# EAGLE board openbook (EAGLE 9.7.0)
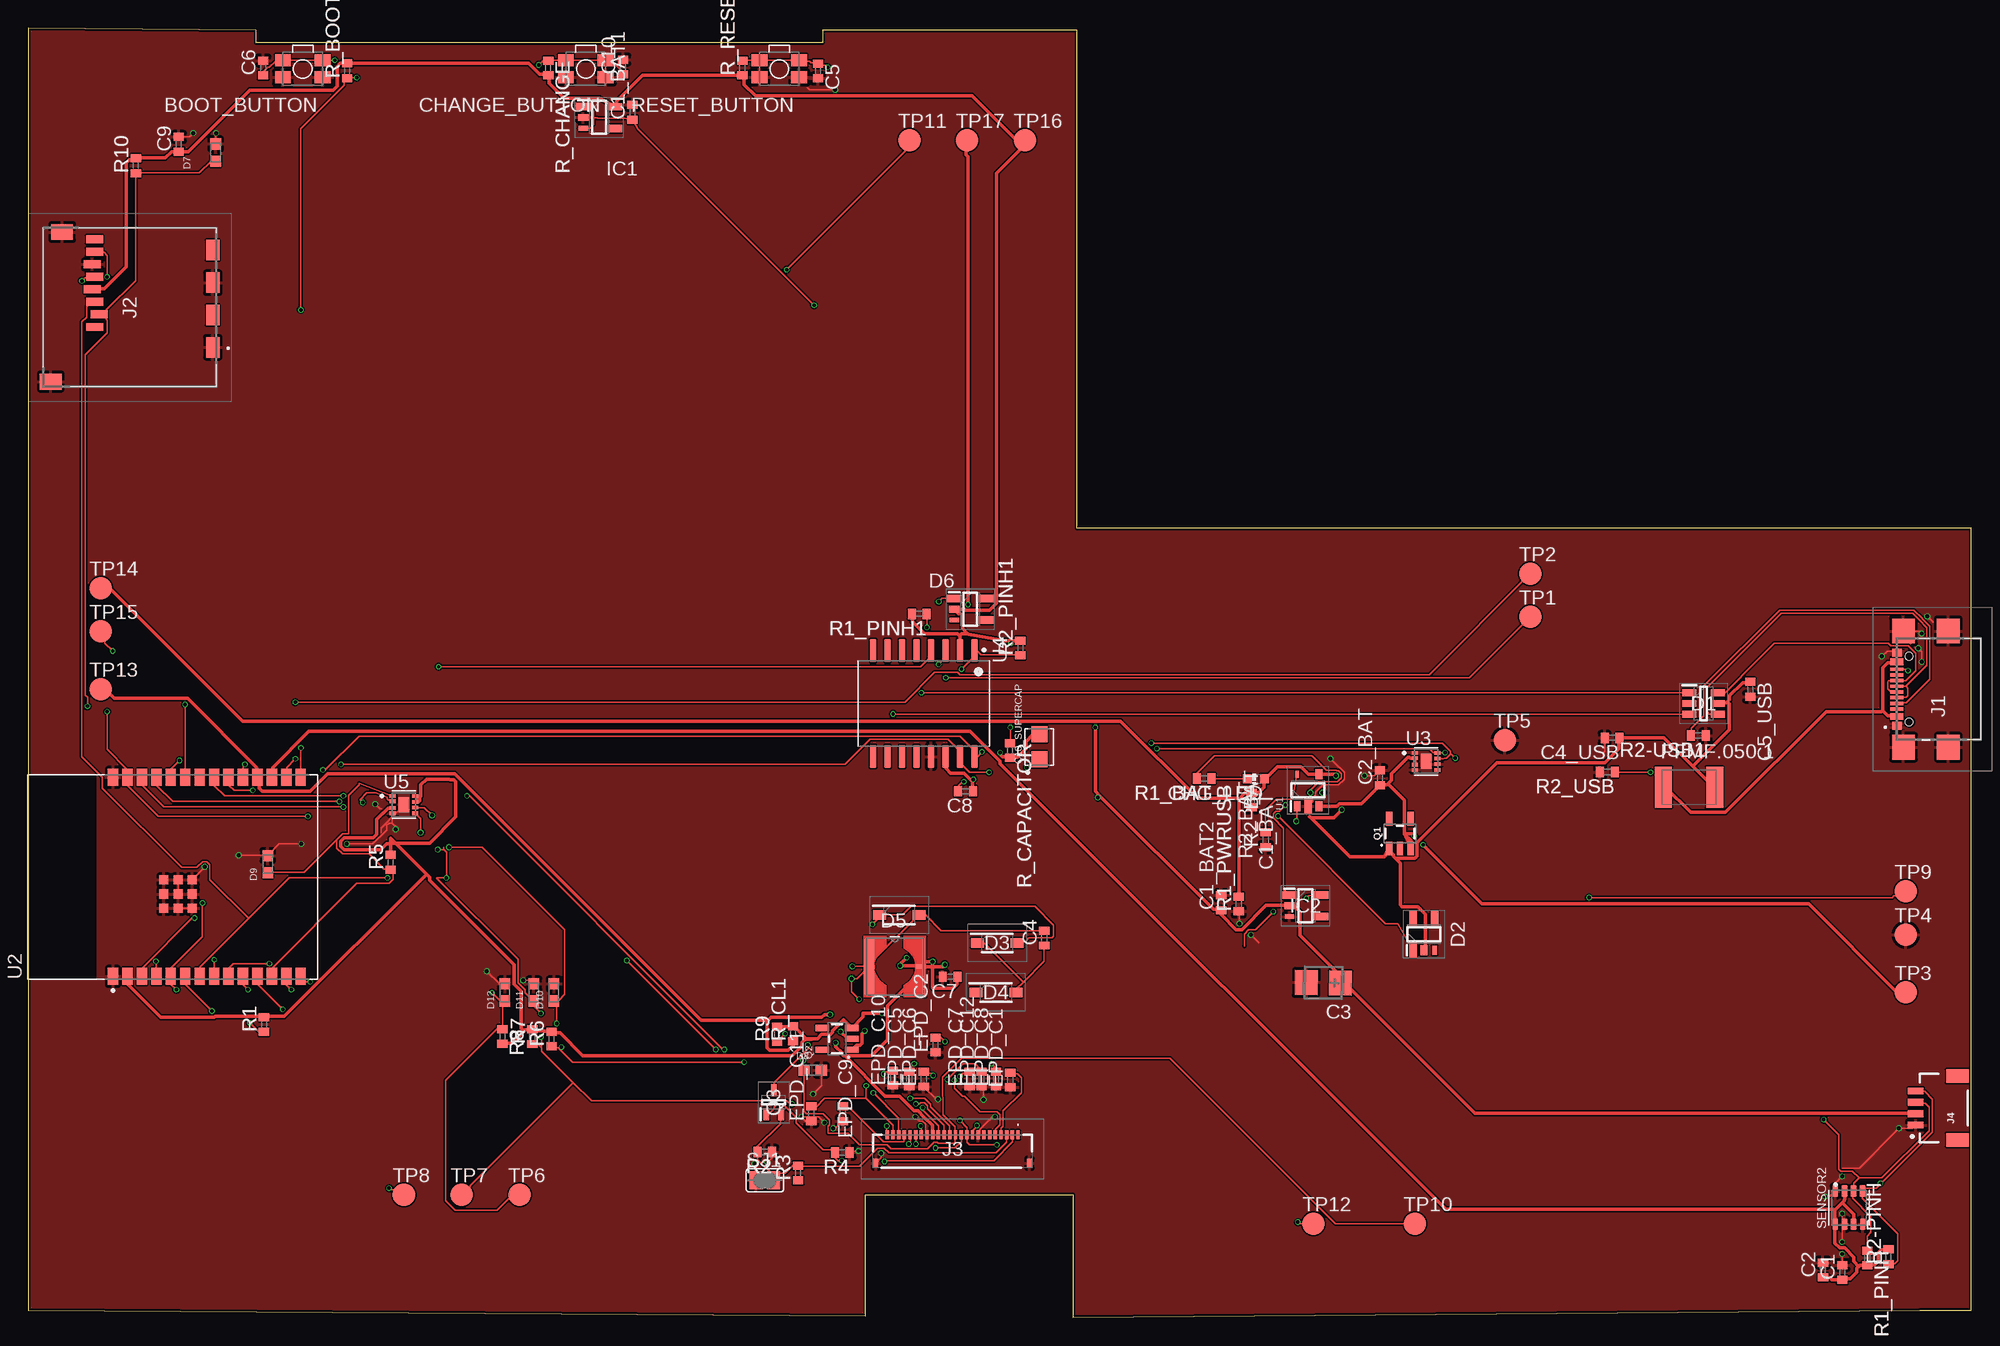
[diagram p1: board, top side]
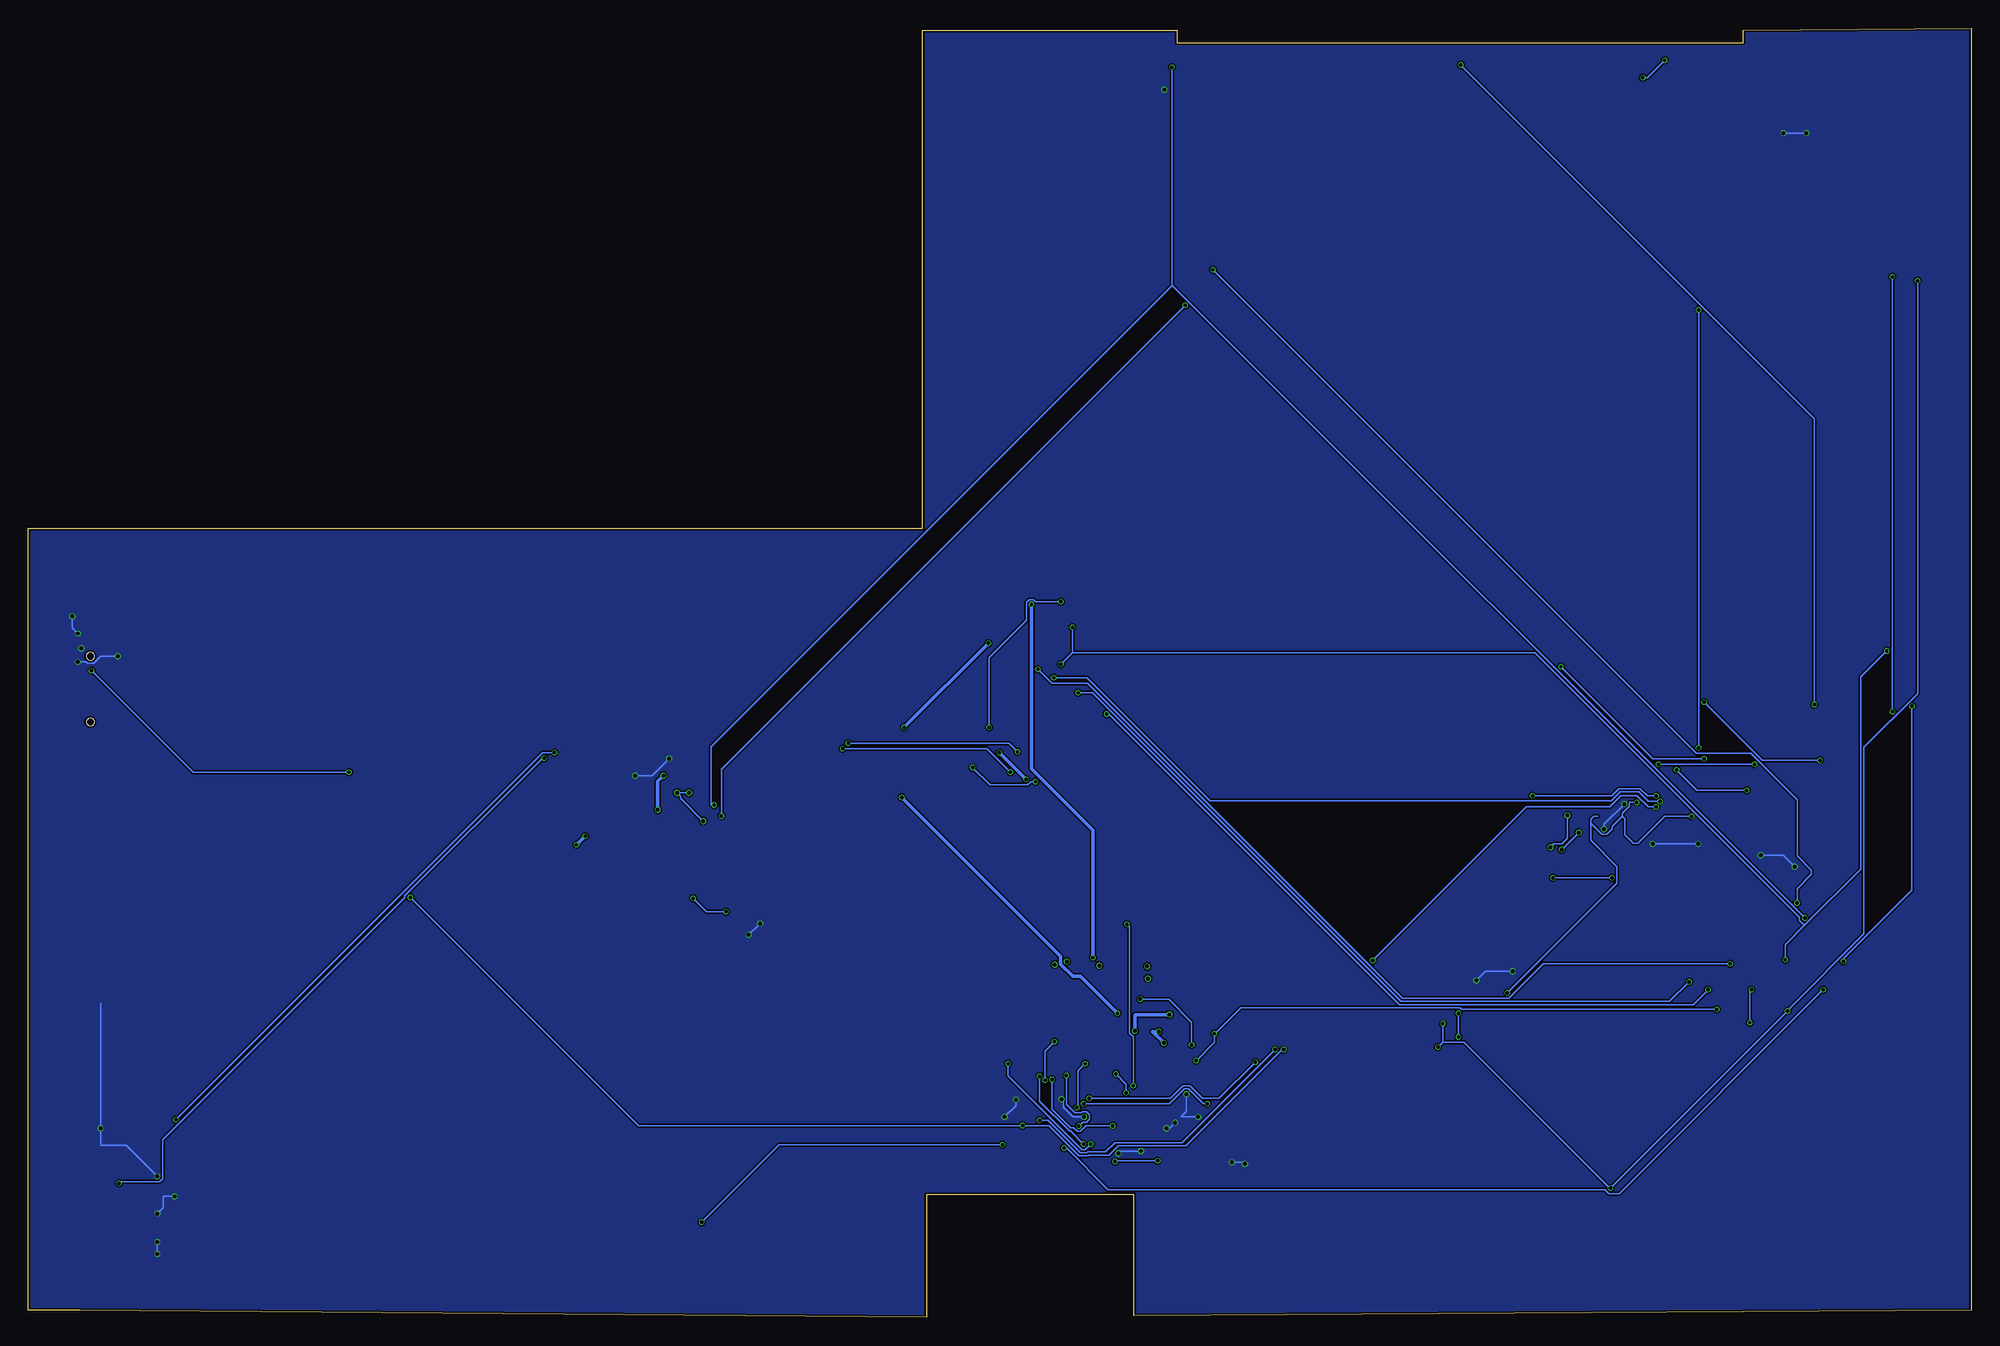
[diagram p2: board, bottom side, seen from below]

Size 170.85 x 113.33 mm. Coordinates in mm from the lower left corner, seen from the top.
Outline: 0,113.33 0,0.63 73.62,0.13 73.62,10.79 73.64,10.77 91.86,10.77 91.86,0 166.35,0.63 170.85,0.63 170.85,69.39 92.22,69.39 92.22,113.19 69.85,113.19 69.85,112.06 20.04,112.06 20.04,113.19 0,113.33
Copper layers (1*16): Top 0.035mm / dielectric 1.6mm / Bottom 0.035mm
Design rules "jlcpcb-2layers.dru": minimum track width 0.15mm, minimum drill 0.3mm, track to track 5mil, track to pad 5mil, pad to pad 5mil, via to via 5mil, smd to smd 5mil, copper to edge 0.2mm, drill to drill 6mil, minimum pad ring 10mil, minimum via ring 3mil, stop-mask expansion 4mil, vias tented up to drill 0mil, thermal gap 10mil
Net classes: 1 POWER: width 0.3 mm

## Footprints (pad centres in the part's own frame; a part is rotated, then mirrored left to right if it is on the bottom)
MYBUTTON = smd 1.4 x 1.05: 1 1.75,0.75; 2 -1.75,0.75; 3 -1.75,-0.75; 4 1.75,-0.75
ESP32_WROVER_EAGLE-LTSPICE_C0402 = smd 0.7 x 0.9: 1 -0.65,0; 2 0.65,0
RCL_CT3528 = smd 2 x 2.2: + -1.5,0; - 1.5,0
CAPCP3225X100N = smd 1.4 x 1.4: 1 -1.1,0; 2 1.1,0
ADAFRUIT_CHIP-LED0603 = smd 0.8 x 0.8: A 0,-0.75; C 0,0.75
SOT95P280X145-6N = smd 1.2 x 0.6: 1 -1.25,0.95; 2 -1.25,0; 3 -1.25,-0.95; 4 1.25,-0.95; 5 1.25,0; 6 1.25,0.95
SOT95P280X120-5N = smd 1.27 x 0.66: 1 -1.4,0.95; 4 1.4,-0.95 | smd 0.9 x 0.6: 2 -1.4,0 | smd 0.813 x 0.406: 3 -1.4,-0.95 | smd 1.27 x 0.635: 5 1.4,0.95
SOD3716X135N = smd 1.15 x 0.8: 1 -1.75,0; 2 1.75,0
DIOC1608X36N = smd 0.97 x 0.94: 1 -0.75,0; 2 0.75,0
SAMACSYS_PARTS_USB4110GFA = smd 0.406 x 0.813: A1 -3.35,3.678; A12 3.35,3.678; B1 3.05,3.678; B12 -3.05,3.678 | smd 0.3 x 1.15: A4 -2.55,3.678; A5 -1.25,3.678; A6 -0.25,3.678; A7 0.25,3.678; A8 1.25,3.678; A9 2.55,3.678; B4 2.25,3.678; B5 1.75,3.678; B6 0.75,3.678; B7 -0.75,3.678; B8 -1.75,3.678; B9 -2.25,3.678 | smd 2.18 x 2: MP1 -5.11,-0.827; MP2 5.11,-0.827; MP3 -5.11,3.103; MP4 5.11,3.103 | hole 0.65: -2.89,2.603; 2.89,2.603
112ATAARR03ATTEND = smd 1.8 x 1.2: G1 10.6,10.4; G2 4.9,10.4; S1 7.75,10.4; S2 2.05,10.4 | smd 1.4 x 1.9: G3 13.6,-3.85; G4 0.45,-2.85 | smd 0.7 x 1.5: P1 8.8,0; P2 7.7,0.4; P3 6.6,0; P4 5.5,-0.2; P5 4.4,0; P6 3.3,-0.2; P7 2.2,0; P8 1.1,0
FH34SRJ24S05SH99 = smd 0.3 x 0.8: 1 5.75,1.45; 2 5.25,1.45; 3 4.75,1.45; 4 4.25,1.45; 5 3.75,1.45; 6 3.25,1.45; 7 2.75,1.45; 8 2.25,1.45; 9 1.75,1.45; 10 1.25,1.45; 11 0.75,1.45; 12 0.25,1.45; 13 -0.25,1.45; 14 -0.75,1.45; 15 -1.25,1.45; 16 -1.75,1.45; 17 -2.25,1.45; 18 -2.75,1.45; 19 -3.25,1.45; 20 -3.75,1.45; 21 -4.25,1.45; 22 -4.75,1.45; 23 -5.25,1.45; 24 -5.75,1.45 | smd 0.4 x 0.8: MP1 6.75,-1.05; MP2 -6.75,-1.05
JST04_1MM_RA = smd 0.6 x 1.35: 1 -1.5,0; 2 -0.5,0; 3 0.5,0; 4 1.5,0 | smd 1.2 x 2: NC1 2.8,-3.675; NC2 -2.8,-3.675
IND_4828-WE-TPC_WRE = smd 0.889 x 4.826: 1 -2.286,0 | smd 0.813 x 0.406: 2 2.286,0
ESP32C6_VARISTOR_CT/CN1812 = smd 1.5 x 3.6: 1 -2.25,0; 2 2.25,0
ESP32_WROVER_SPARKFUN-IC-POWER_SOT23-5 = smd 0.55 x 1.2: 1 -0.95,-1.3; 2 0,-1.3; 3 0.95,-1.3; 4 0.95,1.3; 5 -0.95,1.3
SOT65P210X110-3N = smd 1.05 x 0.5: 1 -1.05,0.65; 2 -1.05,-0.65; 3 1.05,0
ESP32_WROVER_EAGLE-LTSPICE_R0402 = smd 0.7 x 0.9: 1 -0.65,0; 2 0.65,0
ESP32_WROVER_BME680_PSON80P300X300X100-8N = smd 1.016 x 0.5: 1 1.458,1.2; 2 1.458,0.4; 3 1.458,-0.4; 4 1.458,-1.2; 5 -1.458,-1.22; 6 -1.458,-0.4; 7 -1.458,0.4; 8 -1.458,1.2
SJ = smd 1.168 x 1.6: 1 -0.762,0; 2 0.762,0
TP20R = smd 2 x 2: TP 0,0
SOT95P280X125-5N = smd 0.9 x 0.6: 1 -1.4,0.95; 3 -1.4,-0.95; 4 1.4,-0.95 | smd 1.27 x 0.66: 2 -1.4,0 | smd 0.61 x 0.305: 5 1.4,0.95
XCVR_ESP32-C6-WROOM-1-N8 = smd 1.5 x 0.9: 1 -8.75,5.26; 2 -8.75,3.99; 3 -8.75,2.72; 4 -8.75,1.45; 5 -8.75,0.18; 6 -8.75,-1.09; 7 -8.75,-2.36; 8 -8.75,-3.63; 9 -8.75,-4.9; 10 -8.75,-6.17; 11 -8.75,-7.44; 12 -8.75,-8.71; 13 -8.75,-9.98; 14 -8.75,-11.25; 15 8.75,-11.25; 16 8.75,-9.98; 17 8.75,-8.71; 18 8.75,-7.44; 19 8.75,-6.17; 20 8.75,-4.9; 21 8.75,-3.63; 22 8.75,-2.36; 23 8.75,-1.09; 24 8.75,0.18; 25 8.75,1.45; 26 8.75,2.72; 27 8.75,3.99; 28 8.75,5.26 | smd 0.8 x 0.8: 29_1 -2.755,0.79; 29_2 -1.505,0.79; 29_3 -0.255,0.79; 29_4 -2.755,-0.46; 29_5 -1.505,-0.46; 29_6 -0.255,-0.46; 29_7 -2.755,-1.71; 29_8 -1.505,-1.71; 29_9 -0.255,-1.71
SON50P200X200X80-9N = smd 0.61 x 0.305: 1 -0.985,0.75; 2 -0.985,0.3; 3 -0.985,-0.3; 4 -0.985,-0.75; 5 0.985,-0.75; 6 0.985,-0.25; 7 0.985,0.25; 8 0.985,0.75 | smd 0.9 x 1.3: 9 0,0
SOIC127P1032X265-16N = smd 2.05 x 0.59: 1 -4.655,4.445; 2 -4.655,3.175; 3 -4.655,1.905; 4 -4.655,0.635; 5 -4.655,-0.635; 6 -4.655,-1.905; 7 -4.655,-3.175; 8 -4.655,-4.445; 9 4.655,-4.445; 10 4.655,-3.175; 11 4.655,-1.905; 12 4.655,-0.635; 13 4.655,0.635; 14 4.655,1.905; 15 4.655,3.175; 16 4.655,4.445

## Placement (x,y rotation side)
BOOT_BUTTON  BUTTON_CUSYOMV1  [MYBUTTON]  24.13,109.77 180 top
C1  100nF  [ESP32_WROVER_EAGLE-LTSPICE_C0402]  159.52,3.94 90 top
C1_BAT  4.7uF  [ESP32_WROVER_EAGLE-LTSPICE_C0402]  107.58,45.49 270 top
C1_BAT1  4.7uF  [ESP32_WROVER_EAGLE-LTSPICE_C0402]  53.12,105.96 90 top
C1_BAT2  4,7uF  [ESP32_WROVER_EAGLE-LTSPICE_C0402]  104.89,36.46 90 top
C2  100nF  [ESP32_WROVER_EAGLE-LTSPICE_C0402]  157.82,4.16 90 top
C2_BAT  4.7uF  [ESP32_WROVER_EAGLE-LTSPICE_C0402]  118.85,47.45 90 top
C3  100uF TANT  [RCL_CT3528]  113.88,29.42 179 top
C4  4.7uF/25V  [ESP32_WROVER_EAGLE-LTSPICE_C0402]  89.34,33.35 90 top
C4_USB  100nF  [ESP32_WROVER_EAGLE-LTSPICE_C0402]  139.28,50.95 180 top
C5  1uF  [ESP32_WROVER_EAGLE-LTSPICE_C0402]  69.45,109.58 270 top
C5_USB  4.7uF  [ESP32_WROVER_EAGLE-LTSPICE_C0402]  151.43,55.22 270 top
C6  100nF  [ESP32_WROVER_EAGLE-LTSPICE_C0402]  20.64,109.85 90 top
C7  10uF  [ESP32_WROVER_EAGLE-LTSPICE_C0402]  81.06,29.94 180 top
C8  100nF  [ESP32_WROVER_EAGLE-LTSPICE_C0402]  82.41,46.26 180 top
C9  100nF  [ESP32_WROVER_EAGLE-LTSPICE_C0402]  13.22,103.15 90 top
C10  100nF  [ESP32_WROVER_EAGLE-LTSPICE_C0402]  52.29,109.94 90 top
C10_SUPERCAP  CPH3225A  [CAPCP3225X100N]  88.9,50.16 90 top
CHANGE_BUTTON  BUTTON_CUSYOMV1  [MYBUTTON]  49.02,109.77 180 top
CHG_LED  [ADAFRUIT_CHIP-LED0603]  107.95,47.35 90 top
D1  USBLC6-2SC6Y  [SOT95P280X145-6N]  147.32,53.97 0 top
D2  ESP32_WROVER_AVX---SD0805S020S1R0_AVX_SD0805S020S1R0_0_0AVX_SD0805S020S1R0_0_0  [SOT95P280X120-5N]  122.72,33.69 90 top
D3  MBR0530  [SOD3716X135N]  85.2,32.92 0 top
D4  MBR0530  [SOD3716X135N]  85.09,28.57 0 top
D5  MBR0530  [SOD3716X135N]  76.59,35.38 0 top
D6  ESP32_WROVER_AVX---SD0805S020S1R0_AVX_SD0805S020S1R0_0_0AVX_SD0805S020S1R0_0_0  [SOT95P280X120-5N]  82.82,62.26 0 top
D7  PGB1010603MR  [DIOC1608X36N]  16.47,102.42 90 top
D8  PGB1010603MR  [DIOC1608X36N]  68.98,21.73 0 top
D9  PGB1010603MR  [DIOC1608X36N]  21.05,39.86 90 top
D10  PGB1010603MR  [DIOC1608X36N]  46.22,28.57 90 top
D11  PGB1010603MR  [DIOC1608X36N]  44.45,28.57 90 top
D12  PGB1010603MR  [DIOC1608X36N]  41.91,28.57 90 top
EPD_C1  1uF/50V  [ESP32_WROVER_EAGLE-LTSPICE_C0402]  86.35,20.87 90 top
EPD_C2  1uF/50V  [ESP32_WROVER_EAGLE-LTSPICE_C0402]  79.77,23.95 90 top
EPD_C5  1uF/50V  [ESP32_WROVER_EAGLE-LTSPICE_C0402]  77.47,20.95 90 top
EPD_C6  1uF/50V  [ESP32_WROVER_EAGLE-LTSPICE_C0402]  78.74,20.95 90 top
EPD_C7  1uF/50V  [ESP32_WROVER_EAGLE-LTSPICE_C0402]  82.79,20.95 90 top
EPD_C8  1uF/50V  [ESP32_WROVER_EAGLE-LTSPICE_C0402]  85.09,20.95 90 top
EPD_C9  1uF/50V  [ESP32_WROVER_EAGLE-LTSPICE_C0402]  71.62,17.91 90 top
EPD_C10  1uF/50V  [ESP32_WROVER_EAGLE-LTSPICE_C0402]  76.02,21.05 90 top
EPD_C11  1uF/50V  [ESP32_WROVER_EAGLE-LTSPICE_C0402]  68.85,17.91 90 top
EPD_C12  1uF/50V  [ESP32_WROVER_EAGLE-LTSPICE_C0402]  83.82,20.95 90 top
IC1  XC6220A331MR-G  [SOT95P280X120-5N]  50.19,105.5 0 top
IC2  BD5229G-TR  [SOT95P280X120-5N]  112.3,36.19 0 top
J1  SAMACSYS_PARTS_USB4110-GF-A  [SAMACSYS_PARTS_USB4110GFA]  168,55.24 90 top
J2  112A-TAAR-R03_ATTEND  [112ATAARR03ATTEND]  5.82,95.88 270 top
J3  FH34SRJ-24S-0.5SH_99_  [FH34SRJ24S05SH99]  81.28,14.6 0 top
J4  QWIIC_RIGHT_ANGLE  [JST04_1MM_RA]  165.97,18.41 90 top
L1  68uH  [IND_4828-WE-TPC_WRE]  76.2,30.84 0 top
PFMF.050.1  ESP32C6_VARISTORCN1812  [ESP32C6_VARISTOR_CT/CN1812]  146.05,46.62 0 top
Q1  20V/4.2A/52mΩ/1.4W  [ESP32_WROVER_SPARKFUN-IC-POWER_SOT23-5]  120.61,42.54 0 top
Q2  20V/4.2A/52mΩ/1.4W  [ESP32_WROVER_SPARKFUN-IC-POWER_SOT23-5]  71.12,24.49 90 top
Q3  SI1308EDL-T1-GE3  [SOT65P210X110-3N]  65.54,18.91 90 top
R1  10K  [ESP32_WROVER_EAGLE-LTSPICE_R0402]  20.72,25.76 90 top
R1_BAT  200  [ESP32_WROVER_EAGLE-LTSPICE_R0402]  103.4,47.38 180 top
R1_PINH  10K  [ESP32_WROVER_EAGLE-LTSPICE_R0402]  161.71,5.23 270 top
R1_PINH1  10K  [ESP32_WROVER_EAGLE-LTSPICE_R0402]  78.35,61.85 180 top
R1_PWRUSB  100K  [ESP32_WROVER_EAGLE-LTSPICE_R0402]  106.44,36.35 90 top
R2  2.2  [ESP32_WROVER_EAGLE-LTSPICE_R0402]  64.76,14.54 180 top
R2-PINH  10K  [ESP32_WROVER_EAGLE-LTSPICE_R0402]  163.58,5.33 90 top
R2-USB1  5k1  [ESP32_WROVER_EAGLE-LTSPICE_R0402]  146.86,51.16 180 top
R2_BAT  2K  [ESP32_WROVER_EAGLE-LTSPICE_R0402]  108.81,41.99 90 top
R2_PINH1  10K  [ESP32_WROVER_EAGLE-LTSPICE_R0402]  87.23,58.85 90 top
R2_USB  5K1  [ESP32_WROVER_EAGLE-LTSPICE_R0402]  138.86,47.95 180 top
R3  0.47  [ESP32_WROVER_EAGLE-LTSPICE_R0402]  67.68,12.69 90 top
R4  10K  [ESP32_WROVER_EAGLE-LTSPICE_R0402]  71.57,14.5 180 top
R5  10K  [ESP32_WROVER_EAGLE-LTSPICE_R0402]  31.86,40.01 90 top
R6  10K  [ESP32_WROVER_EAGLE-LTSPICE_R0402]  46.01,24.47 90 top
R7  10K  [ESP32_WROVER_EAGLE-LTSPICE_R0402]  44.32,24.69 90 top
R8  10K  [ESP32_WROVER_EAGLE-LTSPICE_R0402]  41.69,24.69 270 top
R9  10K  [ESP32_WROVER_EAGLE-LTSPICE_R0402]  65.84,24.89 90 top
R10  10K  [ESP32_WROVER_EAGLE-LTSPICE_R0402]  9.45,101.26 90 top
R_BOOT  10k  [ESP32_WROVER_EAGLE-LTSPICE_R0402]  28.04,109.6 90 top
R_CAPACITOR  15  [ESP32_WROVER_EAGLE-LTSPICE_R0402]  86.32,49.85 270 top
R_CHANGE  10k  [ESP32_WROVER_EAGLE-LTSPICE_R0402]  45.72,109.85 270 top
R_CL1  10K  [ESP32_WROVER_EAGLE-LTSPICE_R0402]  67.25,24.94 90 top
R_RESET  10k  [ESP32_WROVER_EAGLE-LTSPICE_R0402]  62.78,109.85 90 top
RESET_BUTTON  BUTTON_CUSYOMV1  [MYBUTTON]  66.04,109.77 180 top
SENSOR2  ESP32_WROVER_BME680_BME680  [ESP32_WROVER_BME680_PSON80P300X300X100-8N]  160.11,9.65 90 top
SJ1  [SJ]  64.77,12.06 0 top
TP1  TPTP20R  [TP20R]  132.08,61.59 0 top
TP2  TPTP20R  [TP20R]  132.08,65.4 0 top
TP3  TPTP20R  [TP20R]  165.1,28.57 0 top
TP4  TPTP20R  [TP20R]  165.1,33.65 0 top
TP5  TPTP20R  [TP20R]  129.84,50.75 0 top
TP6  TPTP20R  [TP20R]  43.18,10.79 0 top
TP7  TPTP20R  [TP20R]  38.1,10.79 0 top
TP8  TPTP20R  [TP20R]  33.02,10.79 0 top
TP9  TPTP20R  [TP20R]  165.1,37.46 0 top
TP10  TPTP20R  [TP20R]  121.92,8.25 0 top
TP11  TPTP20R  [TP20R]  77.47,103.5 0 top
TP12  TPTP20R  [TP20R]  113.03,8.25 0 top
TP13  TPTP20R  [TP20R]  6.35,55.24 0 top
TP14  TPTP20R  [TP20R]  6.35,64.13 0 top
TP15  TPTP20R  [TP20R]  6.35,60.32 0 top
TP16  TPTP20R  [TP20R]  87.63,103.5 0 top
TP17  TPTP20R  [TP20R]  82.55,103.5 0 top
U1  ESP32_WROVER_SPARKFUN-IC-POWER_MCP73831  [SOT95P280X125-5N]  112.53,46.35 90 top
U2  ESP32-C6-WROOM-1-N8  [XCVR_ESP32-C6-WROOM-1-N8]  12.7,38.73 90 top
U3  MAX17048G+T10  [SON50P200X200X80-9N]  122.92,48.89 0 top
U4  DS3231SN#  [SOIC127P1032X265-16N]  78.74,53.97 270 top
U5  W25Q512JVEIQ  [SON50P200X200X80-9N]  33.02,45.08 0 top

## Tracks (layer width: path | path; a pad name or v marks a point on that pad's centre or on a via)
3V3  (via drill 0.3)
  Top 0.3: U2.2 8.66,29.92 8.66,29.37 11.63,26.39 16.34,26.39 16.41,26.46 20.71,26.46 R1.2 20.84,26.46 22.51,26.46 35.01,38.96 | R9.2 65.86,25.56 67.24,25.56 R_CL1.2 67.36,25.56 68.4,24.52 68.9,24.52 | 43.59,25.18 43.7,25.28 44.32,25.28 R7.2 44.46,25.21 45.29,25.21 45.36,25.14 45.98,25.14 R6.2 46.05,25.01 46.74,25.01 48.75,23 67.15,23 68.04,23.89 68.04,24.18 68.33,24.47 68.85,24.47 68.9,24.52 | 43.59,25.18 42.52,24.11 41.76,24.11 R8.2 | U5.8 34.32,45.83 34.41,45.73 34.41,45.42 34.32,45.33 U5.7 34.51,45.83 34.51,46.83 35.01,47.33 37.01,47.33 37.08,47.26 37.4,47.26 37.59,47.07 37.59,44 35.28,41.69 31.99,41.69 31.86,41.63 | 31.86,41.63 31.86,42.11 35.01,38.96 | 31.86,41.63 31.86,40.73 R5.2 | J4.2 165.92,17.94 127.21,17.94 115.79,29.37 115.44,29.37 C3.+ 115.3,29.51 115.3,30.13 111.81,33.62 111.81,35.68 111.34,36.15 111.02,36.15 IC2.2 110.89,36.22 108.84,36.22 106.72,34.1 106.2,34.1 104.91,35.39 104.91,35.81 C1_BAT2.1 104.78,35.88 104.22,35.88 94.22,45.88 | J2.P4 5.68,90.45 6.65,90.45 8.59,92.39 8.59,101.53 8.86,101.8 9.35,101.8 R10.2 9.49,101.94 12.05,101.94 12.6,102.5 13.16,102.5 C9.1 13.37,102.5 14.06,102.5 19.46,107.9 26.8,107.9 27.15,108.24 27.15,109.98 27.42,110.25 27.91,110.25 R_BOOT.2 43.97,110.25 44.94,109.28 45.64,109.28 R_CHANGE.2 45.77,109.14 45.77,108.52 47.09,107.21 50.21,107.21 50.23,107.18 IC1.5 51.73,106.48 51.73,106.93 54.02,109.21 62.74,109.21 R_RESET.1 62.81,109.07 62.95,108.94 62.95,108.38 63.93,107.4 82.97,107.4 86.84,103.54 87.6,103.54 TP16.TP 87.25,103.4 87.25,102.7 85.13,100.58 85.13,62.78 84.53,62.18 82.42,62.18 82.34,62.26 D6.2 81.79,61.89 81.98,61.89 82.15,61.72 82.15,60.58 82.51,60.22 82.41,60.12
  Top 0.3: 81.89,59.94 81.92,59.91 81.92,58.66 U4.2 | 81.89,59.94 81.72,60.12 78.81,60.12 77.77,61.15 77.77,61.85 R1_PINH1.2 | 82.41,60.12 82.06,60.12 81.89,59.94 | 86.42,59.49 85.87,59.49 82.41,60.12 | 86.42,59.49 87.19,59.49 R2_PINH1.2 | 94.22,45.88 93.83,46.27 v93.83,51.87 | v86.42,59.28 86.42,59.49 | v75.07,26.74 73.42,26.74 73.42,26.44 Q2.3 71.67,26.19 70.7,25.22 70.7,25.05 70.53,24.89 69.76,24.89 69.4,24.52 68.9,24.52 | v94.04,45.71 94.22,45.88 | 43.59,25.18 43.34,25.44 43.34,28.66 42.7,29.3 42.7,31.01 35.27,38.44 35.27,38.7 35.01,38.96 | 31.86,41.63 31.5,41.63 30.97,41.1 27.78,41.1 27.47,41.41 27.47,41.85 27.78,42.16 30.32,42.16 30.65,42.48 30.65,43.82 31.15,44.33 31.2,44.33 31.64,44.76 32.01,44.76 U5.3
  Bottom 0.3: v86.42,59.28 v93.83,51.87 | v75.07,26.74 78.32,29.99 78.98,29.99 80.06,31.07 80.06,31.73 v94.04,45.71
32KHZ  (via drill 0.3)
  Top 0.15: R2_PINH1.1 87.19,58.25 83.79,58.25 83.38,58.66 83.24,58.66 U4.1 83.17,58.59 83.17,58.11 v82.06,57 | v21.19,31.1 18,31.1 17.66,30.75 17.66,29.99 U2.9
  Bottom 0.15: v21.19,31.1 37.6,31.1 40.65,28.05 50,28.05 77.7,55.75 80.81,55.75 v82.06,57
DN
  Top 0.15: 165.16,55.48 165.3,55.34 165.3,54.64 165.16,54.51 164.33,54.51 J1.B7 | 165.16,55.48 164.33,55.48 J1.A7 | D1.4 148.54,53.05 147.85,53.05 147.64,53.26 147.64,55.41 154.15,61.92 165.71,61.92 166.27,61.36 166.27,61.33 166.95,60.64 166.95,57.34 165.16,55.54 165.16,55.48
DP
  Top 0.15: J1.A6 164.26,54.99 163.78,54.99 163.5,55.27 163.5,55.89 163.57,55.96 164.26,55.96 J1.B6 164.33,55.96 165.09,55.96 166,56.87 166,58.38 165.32,59.06 164.68,59.06 164.5,59.06 163.79,59.06 163.57,59.28 153.53,59.28 150.62,56.38 150.62,56.31 149.23,54.92 148.61,54.92 D1.6
EPD_3V3  (via drill 0.3, 0.35)
  Top 0.3: C7.1 81.65,29.92 81.65,29.3 81.3,28.95 79.57,28.95 79.53,28.99 v79.53,31.28 78.93,31.28 L1.2 | J3.16 79.5,16.07 79.5,16.9 78.78,17.62 78.76,17.62 78.22,18.16 77.9,18.16 76.59,19.47 75.34,19.47 71.82,22.99 | L1.2 78.46,30.65 78.46,30.3 75.57,27.41 75.57,24.42 74.14,22.99 71.82,22.99 | v77.24,31.62 76.67,31.05 v76.67,30.92 78.4,30.92 L1.2 | TP17.TP 82.55,103.47 82.55,102.57 82.48,102.5 82.48,102.22 82.63,102.06 v82.63,62.68 | v80.59,31.01 80.42,30.84 L1.2 | 71.82,22.99 71.7,22.99 71.54,23.15 71.54,23.27 71,23.81 v71,24.13 | v71.44,25.13 72.08,24.49 Q2.2
  Bottom 0.3: v77.24,31.62 77.24,42.83 82.63,48.22 v82.63,62.68 | v71,24.13 72,25.13 v71.44,25.13
EPD_3V3_C  (via drill 0.35)
  Top 0.3: 64.96,26.04 64.96,23.69 65.16,23.48 66.83,23.48 67.24,23.9 67.24,24.24 R_CL1.1 | 64.96,26.04 65.3,26.39 69.74,26.39 69.75,26.38 70,26.63 v70.5,26.63 | TP13.TP 6.37,55.2 6.79,55.2 7.55,54.44 13.99,54.44 20.08,48.34 20.08,47.51 U2.18 20.29,47.44 20.29,46.54 20.57,46.27 24.79,46.27 26.32,47.79 37.48,47.79 59.15,26.11 64.82,26.11 64.96,26.04 | v73.55,25.19 73.3,24.94 73.3,24.1 73.14,23.94 72.82,23.94 Q2.1
  Bottom 0.3: v73.55,25.19 73.55,26.58 73.5,26.63 v70.5,26.63
EPD_BUSY  (via drill 0.3)
  Top 0.15: v137.25,36.92 163.91,36.92 164.05,37.05 164.19,37.05 164.54,37.4 165.09,37.4 TP9.TP | J3.9 83.03,16.07 83.03,16.42 83.41,16.8 v83.41,16.87 | v27.7,44.88 11.91,44.88 10.04,46.75 10.04,47.44 U2.26 | v60.45,23.55 v52.63,31.38
  Bottom 0.15: 83.45,16.83 117.17,16.83 v137.25,36.92 | v52.63,31.38 39.13,44.88 31.78,44.88 30.8,45.86 29.38,45.86 28.4,44.88 v27.7,44.88 | v60.45,23.55 60.59,23.55 69.06,15.08 75,15.08 75.81,14.27 77.56,14.27 77.63,14.2 78.46,14.2 81.09,16.83 83.45,16.83 | v83.41,16.87 83.45,16.83
EPD_CS  (via drill 0.3)
  Top 0.15: v66.55,24.94 65.86,24.24 R9.1 | v68.14,22.58 68.14,21.68 D8.1 68.21,21.68 68.2,21.67 68.2,18.13 68.42,17.91 69.86,17.91 70.45,17.32 70.45,16.94 70.31,16.8 70.31,16.18 72.09,16.18 73.1,15.17 75.49,15.17 75.85,14.81 79.07,14.81 79.64,15.38 79.92,15.38 79.98,15.31 81.44,15.31 81.51,15.38 81.51,16 J3.12 81.51,16.07 81.51,16.76 80.45,17.82 80.45,19.37 80.39,19.43 80.39,21.11 82.06,22.79 100.41,22.79 114.95,8.25 121.88,8.25 TP10.TP | v22.37,27.08 20.15,29.3 20.15,29.92 U2.11
  Bottom 0.15: v68.14,22.58 66.55,24.17 v66.55,24.94 66.48,24.94 64.19,27.22 44.94,27.22 44.8,27.08 v22.37,27.08
EPD_DC  (via drill 0.3)
  Top 0.15: v79.78,14.89 81.51,14.89 82.06,15.45 82.06,16 J3.11 | v13.02,28.81 12.53,29.3 12.53,29.92 U2.5 12.53,29.99 12.53,30.68 15.3,33.45 v15.3,36.43 | v66.69,92.11 77.42,102.84 77.42,103.47 TP11.TP
  Bottom 0.15: v79.78,14.89 79.57,14.89 75.9,11.22 32.2,11.22 31.86,10.88 30.95,10.88 v13.02,28.81 | v66.69,92.11 24.17,49.59 19.39,49.59 15.3,45.5 15.3,40.57 14.05,39.32 14.05,38.94 15.3,37.68 v15.3,36.43
EPD_RST  (via drill 0.3)
  Top 0.15: v85.18,15.17 82.75,15.17 82.55,15.38 82.55,16 J3.10 82.55,16.07 82.55,16.7 v81.92,17.32 | v111.63,8.39 111.77,8.25 113.02,8.25 TP12.TP | v27.7,45.85 17.24,45.85 16.34,46.75 16.34,47.44 U2.21 | v38.57,45.85 38.78,45.85 61.08,23.55 v61.22,23.55
  Bottom 0.15: v85.18,15.17 104.84,15.17 v111.63,8.39 | v81.92,17.32 81.16,17.32 78.32,14.48 77.77,14.48 77.7,14.55 76.11,14.55 75.3,15.36 69.41,15.36 v61.22,23.55 | v27.7,45.85 28.48,45.85 29.11,46.48 30.97,46.48 31.6,45.85 v38.57,45.85
FLASH_CS
  Top 0.15: 28.18,42.53 28.18,45.92 29.09,46.82 29.09,46.96 U5.1 | D9.1 21.05,39.13 24.26,39.13 27.12,41.99 | 28.18,42.53 28.12,42.53 28.1,42.51 27.64,42.51 | U2.12 21.47,29.99 21.47,30.75 28.88,38.16 31.72,38.16 32.06,38.51 32.06,39.2 31.92,39.34 R5.1 31.86,39.41 31.3,39.41 29.96,40.75 27.64,40.75 27.12,41.26 27.12,41.99 | 27.64,42.51 27.12,41.99 | 27.64,42.51 27.12,41.99 | 28.18,42.53 28.17,42.51 27.64,42.51
GDR  (via drill 0.3)
  Top 0.15: v71.53,13.79 71.47,13.72 71.26,13.72 70.91,14.06 70.91,14.48 R4.2 70.91,14.55 70.7,14.76 69.87,14.76 67.53,17.1 67.53,17.58 66.34,18.77 65.86,18.77 65.58,18.5 65.58,18.36 65.09,17.87 64.96,17.87 Q3.1 | J3.2 86.56,16 86.56,15.45 84.9,13.79 75.38,13.79 v75.29,13.7
  Bottom 0.15: v71.53,13.79 75.21,13.79 v75.29,13.7
GND  (via drill 0.35)
  Top 0.15: U2.29_5 13.16,37.26 13.16,38.44 U2.29_6
  Top 0.152: EPD_C9.1 70.99,16.63 v70.78,16.63 | v70,17.13 69.5,17.63 v67.98,17.63 68.35,17.26 EPD_C11.1 | R2.1 65.41,14.04 v65,13.63 | v63.86,13.49 64.01,13.34 SJ1.1 | 138.5,49.13 138.5,49.63 138.63,49.76 C4_USB.2 | v166.5,60.13 166.28,60.35 J1.MP4 165,60.25 165,59.77 165.55,59.22 | 167.5,61.13 v167,61.63 | v43.5,29.63 44.14,29.63 D11.2 | J3.MP2 75,14.02 v75,14.44 | v73,14.63 72.35,14.63 R4.1 | D7.2 16.47,104.1 v16.5,104.13 | v14.5,104.13 14.17,103.8 C9.2 | C1.2 159.5,4.61 v159.5,5.57 | v159.5,6.63 159.5,7.98 SENSOR2.7 159.5,8.4 v159.5,9.13 | v158,10.63 158.43,10.63 SENSOR2.1 158.91,11.81 v159.5,12.4 | v70.95,107.93 68.7,107.93 68.5,108.13 | R1_PWRUSB.1 106.5,35.64 v106.5,34.63 | v107.5,33.63 108.2,32.93 | U2.29_9 15.5,39.56 v15.5,39.63 | v18.5,40.63 21.03,40.63 D9.2 22.07,41.63 v24,41.63 | v117.5,47.63 118.38,47.63 C2_BAT.2 | EPD_C12.1 84,20.12 v84,19.13 | J3.8 83.68,16.2 83.68,16.53 84.77,17.63 v85,17.63 | U2.29_4 U2.29_7 | D8.2 69.73,20.36 v69,19.63 | J4.1 165.69,16.63 v164.5,16.63 161,13.13 159.5,13.13 | 166.07,58.7 v166.19,58.82 166.5,58.52 v166.5,57.63 | v163,58.13 163.46,58.59 J1.A12 | D12.2 41.42,29.32 v40.31,30.44 | J3.17 78.89,16.19 78.89,17.01 78.64,17.26 78.37,17.26 v78,17.63 | 31.08,44.7 30.93,44.7 v30.5,45.13 | v80,19.18 79.86,19.18 EPD_C6.1 | v32.29,42.92 32.42,43.05 32,43.46 | 32,43.46 31.71,43.46 31.5,43.26 31.5,42.84 30.29,41.63 v28,41.63 | 32,43.46 32,44.3 U5.4 | 32.14,44.41 32.16,44.41 32.18,44.42 32.4,44.42 | 32.4,44.42 32.54,44.57 | 32.54,44.57 32.54,44.6 U5.9 | 33.5,44.63 32.61,44.63 32.54,44.57 | 31,42.63 31,43.02 32.4,44.42 | v114.5,49.13 115.27,48.36 115.3,48.36 115.73,47.93 115.73,47.33 115.22,46.82 113.85,46.82 113.2,46.17 113.2,45.89 112.98,45.67 112.98,45.4 U1.2
  Bottom 0.152: v65,13.63 64,13.63 v63.86,13.49 | v167,61.63 167,60.63 v166.5,60.13 | v16.5,104.13 v14.5,104.13 | v159.5,5.57 v159.5,6.63 | v159.5,9.13 159,9.63 159,10.63 v158,10.63 | v106.5,34.63 v107.5,33.63 | v15.5,39.63 16.5,40.63 v18.5,40.63 | v114.5,49.13 116,47.63 v117.5,47.63 | v84,19.13 84,18.63 v85,17.63 | v78,17.63 79,17.63 79.83,18.45 79.83,19 v80,19.18 | v24,41.63 v28,41.63 | v69,19.63 69,18.13 69.5,17.63 v67.98,17.63 | 164.5,27.63 v164.5,16.63 164.5,15.13 162.23,15.13 v159.5,12.4 | v166.5,57.63 165.75,57.63 165.65,57.53 165.1,57.53 164.5,58.13 v163,58.13 | v75,14.44 74.81,14.63 v73,14.63 | 70.64,16.49 | v70.78,16.63 70.64,16.49 | 70.64,16.49 v70,17.13 | v43.5,29.63 42.69,30.44 v40.31,30.44 | v32.29,42.92 32.29,43.34 v30.5,45.13
  pour Top: 91.92,10.81 91.93,10.78 91.93,0.08 166.33,0.71 166.33,0.71 166.35,0.71 166.36,0.71 166.36,0.71 170.77,0.71 170.77,69.31 92.21,69.31 92.18,69.32 92.16,69.34 92.15,69.37 92.15,113.11 69.93,113.11 69.93,112.04 69.91,112.02 69.89,111.99 69.87,111.98 20.02,111.98 19.99,111.99 19.97,112.02 19.96,112.04 19.96,113.12 0.08,113.25 0.08,0.7 73.54,0.2 73.54,10.8 73.56,10.83 73.58,10.85 73.6,10.87 73.64,10.87 73.66,10.85 73.67,10.85 91.87,10.85 91.9,10.83
  pour Bottom: 91.92,10.81 91.93,10.78 91.93,0.08 166.33,0.71 166.33,0.71 166.35,0.71 166.36,0.71 166.36,0.71 170.77,0.71 170.77,69.31 92.21,69.31 92.18,69.32 92.16,69.34 92.15,69.37 92.15,113.11 69.93,113.11 69.93,112.04 69.91,112.02 69.89,111.99 69.87,111.98 20.02,111.98 19.99,111.99 19.97,112.02 19.96,112.04 19.96,113.12 0.08,113.25 0.08,0.7 73.54,0.2 73.54,10.8 73.56,10.83 73.58,10.85 73.6,10.87 73.64,10.87 73.66,10.85 73.67,10.85 91.87,10.85 91.9,10.83
GPIO8  (via drill 0.3)
  Top 0.15: v19.46,25.91 20.22,25.14 20.71,25.14 R1.1 | v19.32,28.81 18.84,29.3 18.84,29.92 U2.10
  Bottom 0.15: v19.46,25.91 19.46,28.68 v19.32,28.81
I2C_PW
  Top 0.3: C2.1 157.82,3.47 158.44,3.47 158.58,3.33 159.48,3.33 C1.1 159.62,3.4 160.24,3.4 160.8,3.95 160.8,4.3 160.97,4.47 | R2-PINH.2 163.57,5.96 162.94,5.96 162.67,5.68 162.67,4.92 162.39,4.65 161.77,4.65 R1_PINH.2 161.56,4.58 161.08,4.58 160.97,4.47 | 158.86,9.42 158.86,8.73 158.93,8.66 158.93,8.25 SENSOR2.8 158.86,8.11 158.86,6.52 159.28,6.1 159.72,6.1 160.52,5.3 160.52,4.92 160.97,4.47 | 159.52,10.08 159.69,10.26 159.69,10.32 159.76,10.39 159.76,11.09 SENSOR2.2 | 159.52,10.08 158.86,9.42 | 159.52,10.08 160.52,9.08 160.52,8.25 SENSOR2.6 | U2.17 21.47,47.51 21.47,48.34 24.65,51.53 82.82,51.53 85.45,48.9 85.45,48.69 124.65,9.49 158.72,9.49 158.86,9.42
INT_RTC  (via drill 0.3)
  Top 0.15: v79.01,60.67 79.01,61.85 R1_PINH1.1 | v80.05,57.41 80.61,57.97 80.61,58.59 U4.3 | v16.34,31.45 16.34,29.99 U2.8 | v7.41,58.59 6.72,59.28 6.72,59.91 6.37,60.25 TP15.TP
  Bottom 0.15: 79.01,58.45 v79.01,60.67 | v80.05,57.41 79.01,58.45 | v16.34,31.45 16.34,32.76 14.65,34.46 | 14.65,34.46 9.7,39.41 9.7,56.31 v7.41,58.59 | 79.01,58.45 38.36,58.45 15.1,35.19 15.1,34.91 14.65,34.46
IO/BOOT  (via drill 0.3)
  Top 0.15: C6.1 20.71,109.21 20.71,109.56 21.05,109.91 21.19,109.91 21.74,110.46 22.37,110.46 BOOT_BUTTON.4 22.44,110.53 25.83,110.53 BOOT_BUTTON.3 25.9,110.53 v26.94,110.53 | v28.88,109.01 28.05,109.01 R_BOOT.1 27.98,108.94 27.77,108.73 27.77,108.31 23.96,104.5 v23.96,88.58 | v23.96,50.07 23.96,47.51 U2.15
  Bottom 0.15: v28.88,109.01 28.46,109.01 v26.94,110.53 | v23.96,88.58 v23.96,50.07
IO/CHANGE  (via drill 0.3)
  Top 0.15: C10.1 52.28,109.35 52.28,109.49 51.31,110.46 50.83,110.46 CHANGE_BUTTON.3 47.3,110.53 CHANGE_BUTTON.4 47.23,110.53 45.77,110.53 R_CHANGE.1 45.7,110.53 45.29,110.53 v44.87,110.11 | v13.78,53.88 13.78,47.51 U2.23
  Bottom 0.15: v13.78,53.88 13.78,79.02 v44.87,110.11
MISO  (via drill 0.3)
  Top 0.15: v40.79,28.54 41.69,27.64 D12.1 41.9,27.78 41.69,27.57 41.69,25.35 R8.1 41.62,25.42 41.27,25.42 36.7,20.85 36.7,10.26 37.53,9.42 41.2,9.42 42.52,10.74 43.14,10.74 TP6.TP | v6.92,91.49 6.92,93.36 6.65,93.63 5.82,93.63 J2.P7 | v6.92,53.26 6.92,49.94 8.66,48.2 8.66,47.51 U2.27 8.73,47.44 8.73,46.75 11.43,44.05 v24.58,44.05 | v29.4,45.27 29.4,45.26 29.15,45.5 29.76,46.11 30.52,46.11 31.53,45.73 31.53,45.62 31.67,45.48 31.94,45.48 U5.2
  Bottom 0.15: v6.92,53.26 v6.92,91.49 | v40.79,28.54 31.15,38.18 31.15,39.64 33.45,41.94 33.45,43.82 | 33.19,44.08 33.45,43.82 | 33.19,44.08 32.81,44.08 33.19,44.08 | 30.68,44.05 30.45,43.82 30.45,42.44 29.69,41.68 29.31,41.68 26.94,44.05 v24.58,44.05 | v29.4,45.27 30,45.27 30.05,45.23 30.05,44.94 30.68,44.31 30.68,44.05 | 33.45,43.82 33.45,43.44 32.48,42.47 32.02,42.47 31.55,42.94 31.55,43.18 30.68,44.05 | 33.45,43.82 33.19,44.08
MOSI  (via drill 0.3, 0.35)
  Top 0.15: v67.17,18.77 66.97,18.77 66.69,19.05 49.51,19.05 47.92,20.64 | 47.92,20.64 45.15,23.41 45.15,23.69 45.05,23.79 | 45.05,23.79 44.74,24.11 44.32,24.11 R7.1 | J3.14 80.54,16.07 80.54,16.9 79.08,18.37 79.08,18.62 78.82,18.87 78.47,18.87 78.37,18.77 v78.05,18.77 | 47.92,20.64 38.85,11.57 38.85,11.5 38.16,10.81 TP7.TP | 19.36,35.08 22.92,38.65 v31.58,38.65 | 19.36,35.08 15.1,30.82 15.1,29.99 U2.7 | J2.P3 5.75,89.27 5.54,89.27 5.12,88.85 5.12,87.95 4.71,87.54 4.71,49.31 6.51,47.51 6.51,46.54 13.47,39.58 14.81,39.58 15.31,40.08 15.69,40.08 15.95,39.82 15.95,38.48 19.36,35.08 | 45.05,23.79 45.15,23.9 45.15,24.59 v45.08,24.66 | v45.08,26.74 44.46,27.36 44.46,27.78 D11.1 44.39,27.84 43.69,28.55 43.69,28.8 43.05,29.44 43.05,31.47 35.91,38.61 35.91,38.65 v36.77,38.65 36.77,40.92 36.53,41.16 | 36.53,41.16 36.53,41.34 | U5.5 34.5,43.83 v34.5,42.63 | v36,41.13 36.51,41.13 36.53,41.16
  Bottom 0.15: v36.77,38.65 v31.58,38.65 | v45.08,26.74 v45.08,24.66 | v67.17,18.77 67.5,18.77 68.81,20.08 69.19,20.08 70.5,18.77 v78.05,18.77 | v34.5,42.63 v36,41.13
N$1  (via drill 0.3)
  Top 0.15: v142.66,47.93 139.54,47.93 R2_USB.1 | v165.3,56.86 165.16,57 J1.B5
  Bottom 0.15: v142.66,47.93 156.37,47.93 v165.3,56.86
N$2  (via drill 0.3)
  Top 0.15: 49.72,105.47 49.72,106.03 49.24,106.51 48.05,106.51 IC1.1 | 49.72,105.47 49.72,104.92 49.38,104.57 48.4,104.57 IC1.3 | v109.9,44.09 119.36,34.63 120.46,34.63 D2.1 | v69.11,88.99 53.64,104.47 C1_BAT1.1 52.48,105.45 50.06,105.45 50.03,105.47 49.72,105.47
  Bottom 0.15: v109.9,44.09 109.9,48.2 v69.11,88.99
N$3
  Top 0.15: R2-USB1.2 146.26,51.18 146.26,51.81 147.36,52.91 147.36,55.54 154.01,62.19 165.82,62.19 166.55,61.47 166.55,61.44 167.23,60.76 167.23,56.09 165.16,54.02 164.33,54.02 J1.A5
N$4
  Top 0.15: 87.5,29.47 86.91,28.88 86.91,28.61 D4.2 | 87.5,29.47 89.33,31.31 C4.1 | 87.5,29.47 84.07,32.9 83.52,32.9 D3.1
N$8  (via drill 0.35)
  Top 0.15: R1_BAT.2 102.77,47.44 102.77,47.86 104.31,49.4 112.86,49.4 114.16,48.1 115.03,48.1 115.05,48.08 115.19,48.08 115.45,47.82 115.45,47.44 115.11,47.1 113.51,47.1 112.75,46.33 v112.75,46.13 112.75,46.04 | U1.1 111.58,43.71 v111.5,43.63 | 113.81,46.1 v113.81,46.13
  Bottom 0.15: v111.5,43.63 113.5,45.63 113.5,45.82 v113.81,46.13 v112.75,46.13
N$9
  Top 0.15: R2_BAT.2 108.79,42.66 108.79,44.6 109.76,45.57 111.16,45.57 U1.5
N$10  (via drill 0.3)
  Top 0.15: v75.48,16.83 75.48,16.07 J3.24 | v80.81,20.92 82.2,22.3 83.24,22.3 83.79,21.75 83.79,21.61 EPD_C12.2
  Bottom 0.15: v75.48,16.83 77.84,16.83 78.32,16.35 78.6,16.35 78.93,16.68 79.19,16.68 80.81,18.3 v80.81,20.92
N$11  (via drill 0.3)
  Top 0.15: v81.44,20.85 81.44,20.16 82.13,19.47 82.31,19.47 83.69,18.08 85.19,18.08 85.45,17.82 85.45,16.94 85.04,16.53 J3.5 | v80.61,24.24 80.19,24.66 79.78,24.66 EPD_C2.2
  Bottom 0.15: v81.44,20.85 81.44,23.41 v80.61,24.24
N$12
  Top 0.15: CHG_LED.C 107.2,47.37 104.08,47.37 R1_BAT.1
N$13  (via drill 0.3)
  Top 0.15: v74.31,19.74 76.52,17.53 76.52,16.07 J3.22 | v75.21,21.4 75.41,21.61 75.9,21.61 75.97,21.68 EPD_C10.2
  Bottom 0.15: v74.31,19.74 74.31,20.5 v75.21,21.4
N$15  (via drill 0.3)
  Top 0.15: v77.42,15.24 77.56,15.38 77.56,16 J3.20 | v84.69,22.3 85.11,21.89 85.11,21.61 EPD_C8.2
  Bottom 0.15: v77.42,15.24 77.91,14.76 78.18,14.76 84.69,21.27 v84.69,22.3
N$16  (via drill 0.3)
  Top 0.15: v78.05,15.24 78.05,16 J3.19 | v81.92,21.2 82.2,21.47 82.68,21.47 82.75,21.54 EPD_C7.2
  Bottom 0.15: v78.05,15.24 79.2,16.4 79.3,16.4 81.92,19.02 v81.92,21.2
N$17  (via drill 0.3)
  Top 0.15: v78.46,16.83 78.46,16.76 78.53,16.7 78.53,16.07 J3.18 | v79.57,21.27 79.36,21.47 78.88,21.47 78.81,21.54 EPD_C6.2
  Bottom 0.15: v79.57,21.27 79.57,19.84 79.55,19.82 79.55,18.74 78.82,18.01 78.26,18.01 78.19,18.08 77.81,18.08 77.55,17.82 77.55,17.44 77.81,17.18 78.12,17.18 v78.46,16.83
N$19  (via drill 0.3)
  Top 0.15: v112.39,36.85 112.6,37.05 113.2,37.14 IC2.5 | v109.48,35.67 107.9,34.08 107.31,34.08 106.92,33.69 106.92,32.62
  Bottom 0.15: v109.48,35.67 111.22,35.67 v112.39,36.85
N$20  (via drill 0.3)
  Top 0.15: v77.91,22.3 77.49,21.89 77.49,21.61 EPD_C5.2 | J3.15 80.05,16.07 80.05,16.85 78.65,18.25 v78.65,18.44
  Bottom 0.15: v77.91,22.3 78.53,21.68 78.53,18.56 v78.65,18.44
N$26  (via drill 0.3)
  Top 0.15: v86.36,51.87 86.36,50.56 R_CAPACITOR.1 | D6.1 80.34,63.21 v80.06,62.93
  Bottom 0.15: v86.36,51.87 86.36,57.99 83.06,61.28 83.06,62.86 82.81,63.11 82.46,63.11 82.28,62.93 v80.06,62.93
N$28  (via drill 0.3)
  Top 0.15: v82.27,47.1 82.13,47.1 81.78,46.75 81.78,46.27 C8.2 | v87.81,48.34 88.5,49.04 88.85,49.04 C10_SUPERCAP.1
  Bottom 0.15: v82.27,47.1 82.68,47.1 82.96,46.82 86.28,46.82 v87.81,48.34
N$29
  Top 0.15: EPD_C1.2 86.36,21.47 86.42,21.4 86.98,21.4 87.32,21.06 87.32,19.74 85.73,18.15 85.73,16.83 85.53,16.63 J3.4
PREVGH
  Top 0.15: J3.21 77.01,16 77.01,15.45 77,15.45 75.21,15.45 72.23,18.43 71.74,18.43 71.67,18.5 EPD_C9.2
PREVGL  (via drill 0.3)
  Top 0.15: 73.68,19.26 76.04,16.9 76.04,16.07 J3.23 | 73.68,19.26 70.01,19.26 69.25,18.5 68.9,18.5 EPD_C11.2 | D3.2 86.98,32.97 87.05,33.04 87.67,33.04 88.02,33.38 90.03,33.38 90.16,33.52 90.16,34.49 88.5,36.15 77.63,36.15 76.87,35.39 74.86,35.39 D5.1 74.79,35.32 74.79,35.12 v74.24,34.56 | v73.68,20.37 73.68,19.26
  Bottom 0.15: v73.68,20.37 73.68,24.68 74,25 74,34.33 v74.24,34.56
RESE
  Top 0.15: Q3.2 66.13,17.8 66.13,17.04 64.06,14.96 64.06,14.55 R2.2 64.13,14.48 64.13,13.86 65.51,12.48 65.51,12.12 SJ1.2 65.58,12.68 66.55,12.68 67.24,13.37 67.66,13.37 R3.2 67.73,13.3 73.1,13.3 74.69,14.89 75.26,14.89 75.69,14.47 85.1,14.47 86.01,15.38 86.01,16 J3.3
RESET  (via drill 0.3)
  Top 0.15: R_RESET.2 62.81,110.53 64.26,110.53 RESET_BUTTON.4 64.33,110.53 67.73,110.53 RESET_BUTTON.3 67.8,110.46 68.7,110.46 68.83,110.32 69.32,110.32 69.39,110.25 C5.1 69.46,110.18 69.53,110.11 70.08,110.11 v70.29,109.91 | v14.61,35.12 14.4,35.12 10.04,30.75 10.04,29.99 U2.3 | IC2.1 110.39,37.66 110.39,43 109.47,43.91 109.47,44.27 109.72,44.52 110.02,44.52 v110.55,45.05
  Bottom 0.15: v70.29,109.91 70.29,90.72 | v14.61,35.12 70.22,90.72 70.29,90.72 | 70.29,90.72 110.83,50.18 110.83,45.05 v110.55,45.05
RTC_RST  (via drill 0.3)
  Top 0.15: v23.48,49.1 22.71,48.34 22.71,47.51 U2.16 | v36.08,57.21 78.46,57.21 79.36,58.11 79.36,58.59 U4.4
  Bottom 0.15: v23.48,49.1 27.98,49.1 v36.08,57.21
RX  (via drill 0.3)
  Top 0.15: v13.3,48.97 12.53,48.2 12.53,47.51 U2.24 | v23.48,54.09 77.08,54.09 79.71,56.72 81.72,56.72 81.92,56.51 123.2,56.51 132.06,65.38 TP2.TP
  Bottom 0.15: v13.3,48.97 18.35,48.97 v23.48,54.09
SCK  (via drill 0.3, 0.35)
  Top 0.15: v62.95,22.44 47.85,22.44 46.71,23.59 | 46.71,23.59 46.6,23.69 46.12,23.69 46.05,23.76 R6.1 | J3.13 81.02,16.07 81.02,16.83 79.35,18.5 79.35,18.73 78.83,19.26 v77.56,19.26 | v46.47,25.84 46.47,27.78 D10.1 46.26,27.84 46.6,27.84 47.16,28.4 47.16,34.08 39.89,41.34 v36.99,41.34 | 46.71,23.59 v46.88,23.76 | v16.14,26.94 13.85,29.23 13.85,29.92 U2.6 | v31.72,11.36 31.86,11.22 32.55,11.22 32.96,10.81 TP8.TP | v4.71,91.14 4.99,91.42 5.75,91.42 J2.P5 | U5.6 34.8,44.83 v35.5,44.13
  Bottom 0.15: v62.95,22.44 66.13,19.26 67.6,19.26 68.7,20.36 69.3,20.36 70.4,19.26 v77.56,19.26 | 46.47,24.17 v46.47,25.84 | v46.88,23.76 46.47,24.17 | v4.71,91.14 4.71,54.85 9.42,50.14 9.42,33.73 16.14,27.01 v16.14,26.94 v31.72,11.36 31.79,11.36 44.6,24.17 46.47,24.17 | v35.5,44.13 35.5,42.13 36,41.63 36.7,41.63 v36.99,41.34
SCL  (via drill 0.3)
  Top 0.15: R2-PINH.1 163.64,4.72 164.12,4.72 164.4,4.99 164.4,7.35 161.28,10.46 161.28,11.09 SENSOR2.4 161.28,11.16 161.49,11.36 162.53,11.36 162.91,11.74 | 162.91,11.74 167.45,16.28 167.45,19.19 166.75,19.88 165.99,19.88 J4.4 | 125.07,49.52 124.72,49.17 124.51,49.17 124.44,49.1 124.23,49.1 124.17,49.17 123.96,49.17 U3.7 | 125.07,49.52 125.07,49.8 124.37,50.49 v98.75,50.49 | v83.86,49.73 83.45,49.31 83.24,49.31 U4.16 83.17,49.38 83.17,49.87 81.92,51.11 29.09,51.11 26.11,48.13 v25.9,48.13 | v19.74,46.33 18.07,46.33 17.66,46.75 17.66,47.44 U2.20 | v125.48,49.17 125.14,49.52 125.07,49.52 | v162.88,11.78 162.91,11.74
  Bottom 0.15: v98.75,50.49 84.62,50.49 v83.86,49.73 | v19.74,46.33 24.1,46.33 v25.9,48.13 | v125.48,49.17 125.62,49.17 137.74,37.05 137.74,36.92 159.05,15.61 159.05,12.21 159.31,11.94 162.71,11.94 v162.88,11.78
SDA  (via drill 0.3)
  Top 0.15: R1_PINH.1 161.7,5.89 161.7,7.14 162.04,7.49 162.04,8.87 160.45,10.46 160.45,11.09 SENSOR2.3 160.52,11.16 160.52,11.78 161.01,12.26 | 161.01,12.26 163.01,12.26 167.17,16.42 167.17,18.5 166.82,18.84 165.99,18.84 J4.3 | v99.23,50 123.2,50 123.54,49.66 123.89,49.66 U3.8 123.96,49.66 v124.58,49.66 | v84.48,47.93 82.75,47.93 81.92,48.76 81.92,49.31 U4.15 81.85,49.38 81.85,49.87 80.88,50.84 74.03,50.84 71.81,48.62 v27.49,48.62 | v19.04,48.62 18.91,48.48 18.91,47.51 U2.19 | 161.01,12.26 160.42,12.85 159.38,12.85 159.22,13.01 159.22,16.06 v157.89,17.39
  Bottom 0.15: v99.23,50 86.56,50 v84.48,47.93 | v27.49,48.62 v19.04,48.62 | v157.89,17.39 125.62,49.66 v124.58,49.66
SRC  (via drill 0.3, 0.35)
  Top 0.15: C4.2 80.26,34.01 78.88,35.39 78.39,35.39 D5.2 78.29,35.38 73.77,30.85 v72.46,30.85 73.9,30.85 L1.1 72.86,29.78 v72.39,29.78 72.39,28.65 v73.06,27.98 | v68.54,23.97 68.54,23.61 65.58,20.64 65.58,20.02 Q3.3
  Bottom 0.15: v73.06,27.98 70.56,27.98 68.54,25.97 v68.54,23.97
SS_SD  (via drill 0.3)
  Top 0.15: D7.1 16.41,101.67 16.07,101.67 15.03,100.63 9.49,100.63 R10.1 9.42,100.56 9.42,91.14 6.86,88.58 6.86,88.51 6.58,88.23 J2.P2 6.23,88.16 6.58,88.16 6.86,87.88 6.86,87.75 6.92,87.68 6.92,86.57 4.99,84.63 4.99,54.71 5.19,54.51 v5.19,53.74 | v11.22,31.31 11.22,29.99 U2.4
  Bottom 0.15: v11.22,31.31 11.22,31.52 5.19,37.54 v5.19,53.74
TX  (via drill 0.3)
  Top 0.15: v27.35,45.37 12.67,45.37 11.29,46.75 11.29,47.44 U2.25 | v80.68,56.24 126.73,56.24 132.06,61.57 TP1.TP
  Bottom 0.15: v80.68,56.24 77.77,56.24 66.95,45.42 31.63,45.42 30.85,46.2 29.23,46.2 28.39,45.37 v27.35,45.37
USB_D+  (via drill 0.3)
  Top 0.15: v78.53,54.92 146.05,54.92 D1.1 | v24.79,29.51 24.38,29.51 23.96,29.92 U2.14
  Bottom 0.15: v78.53,54.92 77.28,54.92 50.14,27.78 26.52,27.78 v24.79,29.51
USB_D-  (via drill 0.3)
  Top 0.15: v76.04,53.05 146.05,53.05 D1.3 | v23.13,28.81 22.64,29.3 22.64,29.92 U2.13
  Bottom 0.15: v76.04,53.05 75.83,53.05 50.28,27.5 24.45,27.5 v23.13,28.81
VBAT  (via drill 0.3)
  Top 0.3: U3.3 121.95,48.62 121.95,49.17 U3.2 121.81,49.17 121.53,49.17 121.47,49.24 121.33,49.24 119.87,47.79 119.87,47.23 119.56,46.92 | 119.56,46.92 119.46,46.82 118.9,46.82 C2_BAT.1 117.21,45.16 115.28,45.16 115.07,44.95 U1.3 | v122.64,41.56 127.83,36.36 156.57,36.36 164.33,28.61 165.09,28.61 TP3.TP | v121.88,42.32 121.67,42.53 121.07,42.53 Q1.3 121.56,41.94 121.01,42.49 121.01,45.48 119.56,46.92
  Bottom 0.3: v121.88,42.32 v122.64,41.56
VBUS  (via drill 0.35)
  Top 0.3: 149.41,54.13 149.3,54.02 148.61,54.02 D1.5 | 149.41,54.13 149.58,54.3 149.58,54.64 150.76,55.82 151.38,55.82 C5_USB.1 | 146.36,48.45 148.13,46.68 148.26,46.68 PFMF.050.1.2 | 146.36,48.45 143.83,50.97 139.95,50.97 C4_USB.1 139.88,50.84 139.88,50.01 138.65,48.78 129.15,48.78 122.11,41.74 122.11,40.52 121.95,40.36 120.22,40.36 | 146.36,48.45 149.58,51.67 149.58,53.95 149.41,54.13 | 106.44,45.57 106.44,37.05 R1_PWRUSB.2 | 106.44,45.57 106.99,46.13 107.48,46.13 C1_BAT.1 107.61,46.13 108.17,46.13 108.65,46.61 108.65,47.3 CHG_LED.A 108.75,47.33 109.86,48.43 111.9,48.43 112.58,47.75 U1.4 114.88,47.75 v115,47.63 | TP14.TP 6.37,64.06 7.2,64.06 18.84,52.43 96.05,52.43 102.84,45.64 106.3,45.64 106.44,45.57 | Q1.1 119.27,40.52 116.22,40.52 112.81,43.94 | 120.06,40.66 120.06,40.52 120.22,40.36 | 120.06,40.66 120.06,40.68 119.66,41.08 Q1.1 | Q1.1 119.66,41.05 120.06,40.66 | 120.22,40.36 120.64,39.95 120.64,36.26 120.8,36.1 122.22,36.1 122.88,35.44 122.88,32.45 D2.2 | v115.5,44.63 114.81,43.94 112.81,43.94 | 112.68,44.04 112.7,44.04 112.81,43.94
  Bottom 0.3: v115,47.63 115.5,47.13 v115.5,44.63
VRTC  (via drill 0.3)
  Top 0.3: C10_SUPERCAP.2 88.85,51.25 88.36,51.25 87.74,50.63 87.74,50 86.98,49.24 86.36,49.24 R_CAPACITOR.2 86.22,49.31 85.66,49.31 85.45,49.52 v85.45,49.66 | 82.93,47.2 82.27,47.86 81.09,47.86 80.68,48.27 80.68,49.31 U4.14 | 82.93,47.2 83.03,47.1 83.03,46.27 C8.1 | v83.1,47.3 83.03,47.3 82.93,47.2
  Bottom 0.3: v83.1,47.3 v85.45,49.66
VUSB
  Top 0.3: J1.A4 164.33,52.71 J1.B9 164.19,52.91 163.5,52.91 163.08,53.33 | J1.A9 164.33,57.76 164.33,57.55 J1.B4 164.19,57.55 163.5,57.55 163.08,57.14 163.08,53.33 | 163.08,53.33 162.94,53.26 158.1,53.26 149.23,44.4 146.19,44.4 143.97,46.61 143.83,46.61 PFMF.050.1.1